# EAGLE design Comm_board_2024_M8N (EAGLE 9.6.2)
CHECKED: 02/25/2025; COMPANY: CDOSR; DATE: 02/25/2024; DESIGNER: CDOSR; DRAWN: 02/25/2024; DRGNO: 1; REV: 01; VERSION: v10; YEAR: 2024
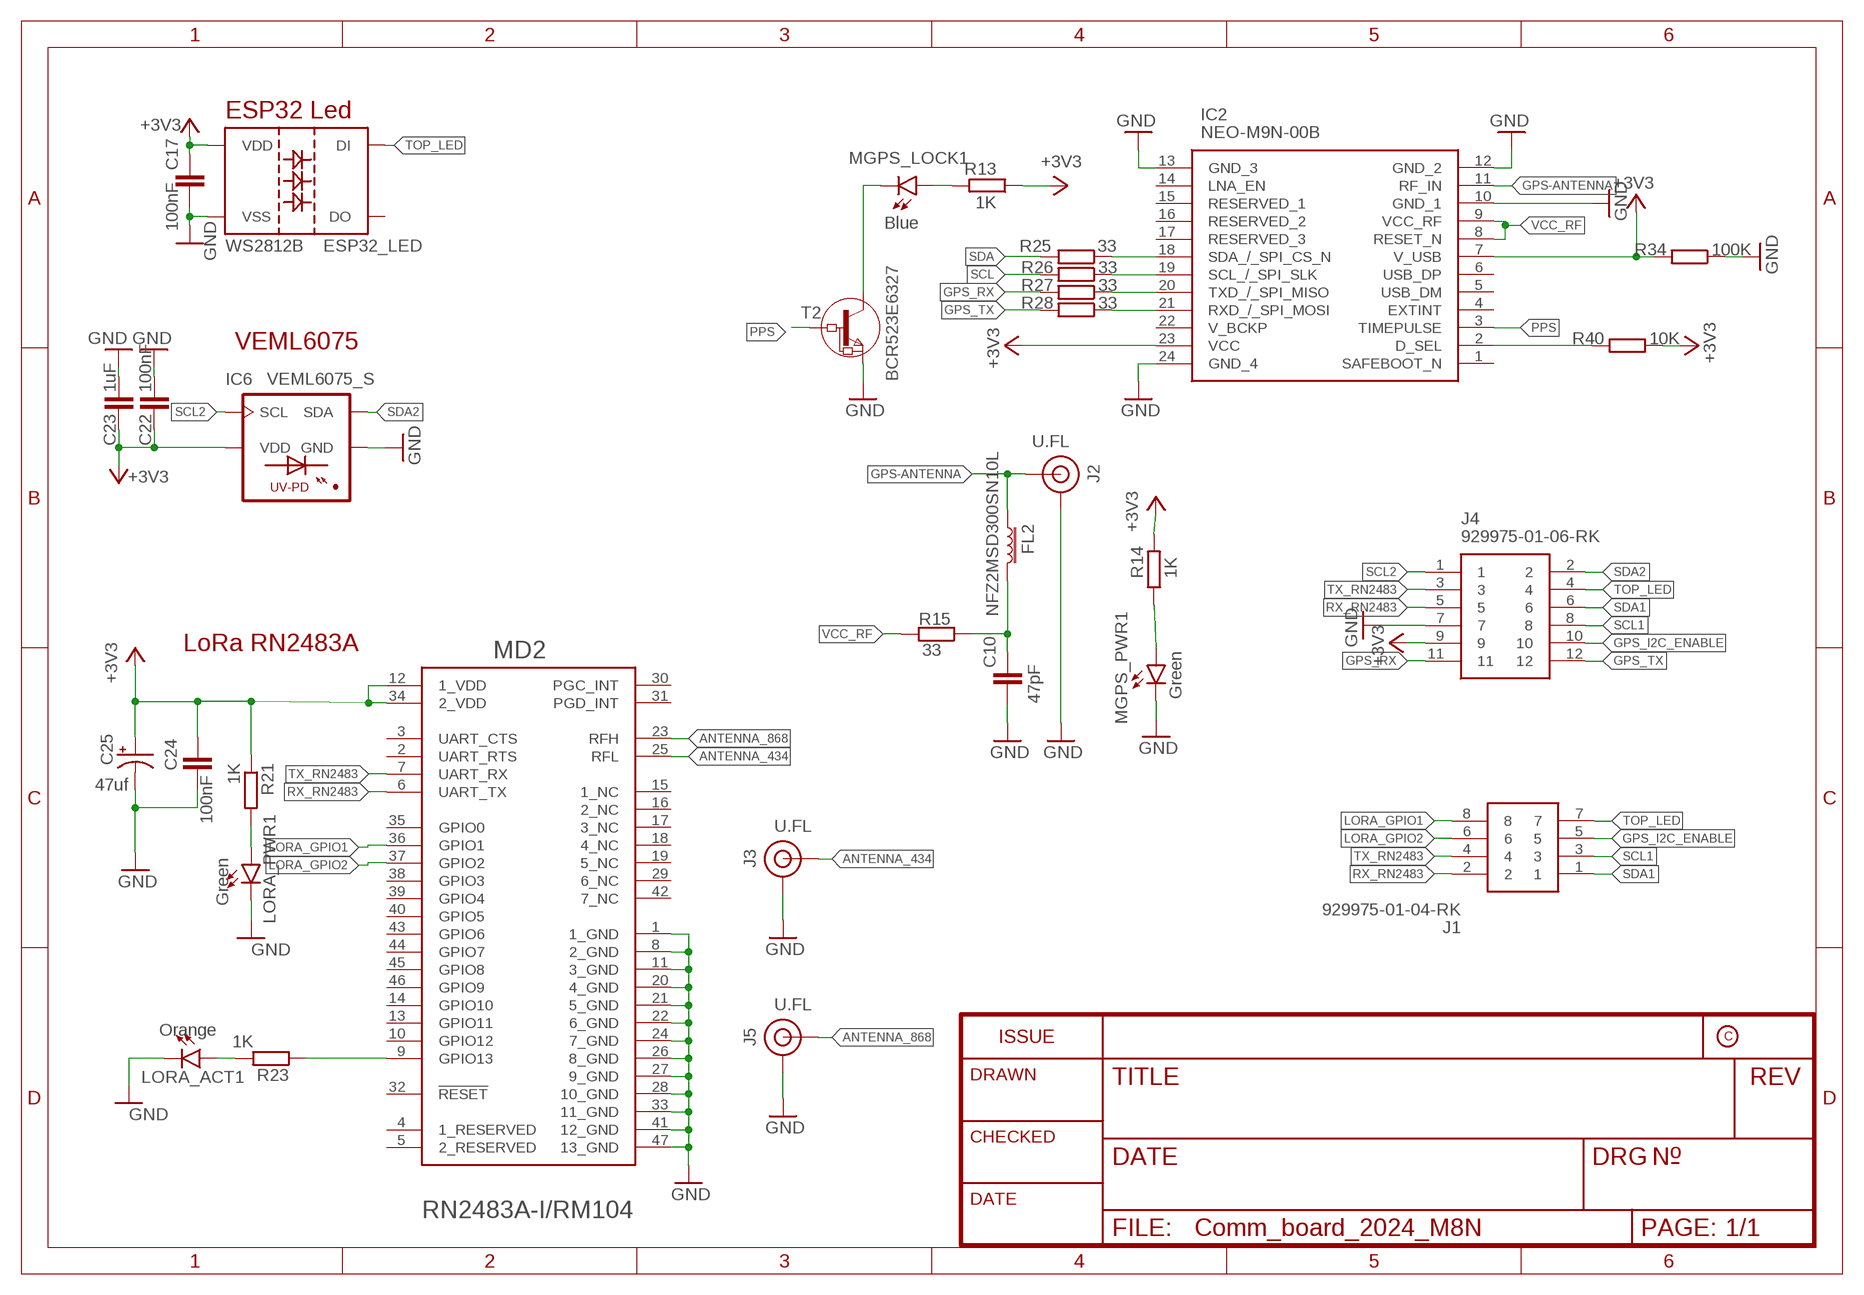
[diagram p0: schematic, sheet 1]

## Parts
C10  47pF  C-EUC0603  [C0603]
C17  100nF  C-EUC0603  [C0603]
C22  100nF  C-EUC0603  [C0603]
C23  1uF  C-EUC0603  [C0603]
C24  100nF  C-EUC0603  [C0603]
C25  47uf  293D226X9025C2TE3  [CAPMP6032X250N]
ESP32_LED  WS2812B  [WS2812B]
FL2  NFZ2MSD300SN10L  [BEADC2016X120N]
IC2  NEO-M9N-00B  [NEOM9N00B]
IC6  VEML6075_S  [VISHAY_VEML6075_1.25X2X1]
J1  929975-01-04-RK  [RHDR8W76P254_2X4_1016X508X839P]
J2  U.FL  SPARKFUN-CONNECTORS_SPARKFUN-CONNECTORS_U.FL2PIN  [SPARKFUN-CONNECTORS_SPARKFUN-CONNECTORS_U.FL]
J3  U.FL  SPARKFUN-CONNECTORS_SPARKFUN-CONNECTORS_U.FL2PIN  [SPARKFUN-CONNECTORS_SPARKFUN-CONNECTORS_U.FL]
J4  929975-01-06-RK  [RHDR12W76P254_2X6_1524X508X839]
J5  U.FL  SPARKFUN-CONNECTORS_SPARKFUN-CONNECTORS_U.FL2PIN  [SPARKFUN-CONNECTORS_SPARKFUN-CONNECTORS_U.FL]
LORA_ACT1  Orange  LEDCHIP-LED0603  [CHIP-LED0603]
LORA_PWR1  Green  LEDCHIP-LED0603  [CHIP-LED0603]
MD2  RM104_MICROCHIP_RN2483A-I-RM104MICROCHIP_RN2483A-I-RM104_0_0  [RM104_MICROCHIP_RN2483A-I-RM104_0]
MGPS_LOCK1  Blue  LEDCHIP-LED0603  [CHIP-LED0603]
MGPS_PWR1  Green  LEDCHIP-LED0603  [CHIP-LED0603]
R13  1K  R-EU_R0603  [R0603]
R14  1K  R-EU_R0603  [R0603]
R15  33  R-EU_R0603  [R0603]
R21  1K  R-EU_R0603  [R0603]
R23  1K  R-EU_R0603  [R0603]
R25  33  R-EU_R0603  [R0603]
R26  33  R-EU_R0603  [R0603]
R27  33  R-EU_R0603  [R0603]
R28  33  R-EU_R0603  [R0603]
R34  100K  R-EU_R0603  [R0603]
R40  10K  R-EU_R0603  [R0603]
T2  BCR523E6327  NPNSOT23  [SOT-23]

## Nets
+3V3: C17.1 C22.2 C23.1 C24.1 C25.1(+) ESP32_LED.1(VDD) IC2.7(V_USB) IC2.23(VCC) IC6.4(VDD) J4.9 MD2.12(1_VDD) MD2.34(2_VDD) R13.1 R14.2 R21.1 R34.2 R40.1
ANTENNA_434: J3.FEED(SIGNAL) MD2.25(RFL)
ANTENNA_868: J5.FEED(SIGNAL) MD2.23(RFH)
GND: C10.2 C17.2 C22.1 C23.2 C24.2 C25.2(-) ESP32_LED.3(VSS) IC2.10(GND_1) IC2.12(GND_2) IC2.13(GND_3) IC2.24(GND_4) IC6.1(GND) J2.1(GND) J2.2(GND) J2.3(GND) J3.1(GND) J3.2(GND) J3.3(GND) J4.7 J5.1(GND) J5.2(GND) J5.3(GND) LORA_ACT1.C LORA_PWR1.C MD2.1(1_GND) MD2.8(2_GND) MD2.11(3_GND) MD2.20(4_GND) MD2.21(5_GND) MD2.22(6_GND) MD2.24(7_GND) MD2.26(8_GND) MD2.27(9_GND) MD2.28(10_GND) MD2.33(11_GND) MD2.41(12_GND) MD2.47(13_GND) MGPS_PWR1.C R34.1 T2.2(E)
GPS-ANTENNA: FL2.1 IC2.11(RF_IN) J2.FEED(SIGNAL)
GPS_I2C_ENABLE: J1.5 J4.10
GPS_RX: J4.11 R27.2
GPS_TX: J4.12 R28.2
LORA_GPIO1: J1.8 MD2.36(GPIO1)
LORA_GPIO2: J1.6 MD2.37(GPIO2)
N$5: MGPS_LOCK1.A R13.2
N$7: MGPS_PWR1.A R14.1
N$13: IC2.20(TXD_/_SPI_MISO) R27.1
N$14: IC2.19(SCL_/_SPI_SLK) R26.1
N$17: IC2.18(SDA_/_SPI_CS_N) R25.1
N$18: IC2.21(RXD_/_SPI_MOSI) R28.1
N$20: IC2.2(D_SEL) R40.2
N$29: MGPS_LOCK1.C T2.1(C)
N$32: C10.1 FL2.2 R15.1
N$41: MD2.9(GPIO13) R23.1
N$42: LORA_ACT1.A R23.2
N$43: LORA_PWR1.A R21.2
PPS: IC2.3(TIMEPULSE) T2.3(B)
RX_RN2483: J1.2 J4.5 MD2.6(UART_TX)
SCL: R26.2
SCL1: J1.3 J4.8
SCL2: IC6.3(SCL) J4.1
SDA: R25.2
SDA1: J1.1 J4.6
SDA2: IC6.2(SDA) J4.2
TOP_LED: ESP32_LED.4(DI) J1.7 J4.4
TX_RN2483: J1.4 J4.3 MD2.7(UART_RX)
VCC_RF: IC2.8(RESET_N) IC2.9(VCC_RF) R15.2
Unconnected: ESP32_LED.2(DO) IC2.1(SAFEBOOT_N) IC2.4(EXTINT) IC2.5(USB_DM) IC2.6(USB_DP) IC2.14(LNA_EN) IC2.15(RESERVED_1) IC2.16(RESERVED_2) IC2.17(RESERVED_3) IC2.22(V_BCKP) MD2.2(UART_RTS) MD2.3(UART_CTS) MD2.4(1_RESERVED) MD2.5(2_RESERVED) MD2.10(GPIO12) MD2.13(GPIO11) MD2.14(GPIO10) MD2.15(1_NC) MD2.16(2_NC) MD2.17(3_NC) MD2.18(4_NC) MD2.19(5_NC) MD2.29(6_NC) MD2.30(PGC_INT) MD2.31(PGD_INT) MD2.32(!RESET!) MD2.35(GPIO0) MD2.38(GPIO3) MD2.39(GPIO4) MD2.40(GPIO5) MD2.42(7_NC) MD2.43(GPIO6) MD2.44(GPIO7) MD2.45(GPIO8) MD2.46(GPIO9)

## Notes on the sheet
- ESP32 Led
- VEML6075
- LoRa RN2483A

## Library data of the parts
C10 C17 C22-C24 = rcl:C-EU: CAPACITOR, European symbol; SPICEPREFIX: C
C25 = 293D226X9025C2TE3:293D226X9025C2TE3: Surface Mount Tantalum Capacitor, TANTAMOUNTr, 293D Series, 22 F, 10%, 25 V, 2412 Check prices <https://pricing.snapeda.com/parts/293D226X9025C2TE3/Vishay/view-part?ref=eda>; AVAILABILITY: Warning; DESCRIPTION: Surface Mount Tantalum Capacitor, TANTAMOUNTr, 293D Series, 22 F, 10%, 25 V, 2412 [6032 Metric]; MF: Vishay; MP: 293D226X9025C2TE3; PACKAGE: None; PRICE: None; PURCHASE-URL: https://pricing.snapeda.com/search/part/293D226X9025C2TE3/?ref=eda
ESP32_LED = WS2812:WS2812B
FL2 = NFZ2MSD300SN10L:NFZ2MSD300SN10L: EMI FILTER SMD 100OHM INFOTMT, A Check availability <https://pricing.snapeda.com/parts/NFZ2MSD300SN10L/Murata/view-part?ref=eda>; AVAILABILITY: In Stock; DESCRIPTION: 30 Ohms @ 10 MHz 1 - Ferrite Bead 0806 (2016 Metric) 3.7A 33mOhm; MF: Murata; MP: NFZ2MSD300SN10L; PACKAGE: 0806 Murata; PRICE: None; PURCHASE-URL: https://pricing.snapeda.com/search/part/NFZ2MSD300SN10L/?ref=eda
IC2 = NEO-M9N-00B:NEO-M9N-00B: M9 standard precision module Source: Datasheet <https://www.u-blox.com/sites/default/files/NEO-M9N_DataSheet_(UBX-19014285).pdf>; DESCRIPTION: M9 standard precision module; HEIGHT: 2.6mm; MANUFACTURER_NAME: U-Blox; MANUFACTURER_PART_NUMBER: NEO-M9N-00B; MOUSER_PART_NUMBER: 377-NEO-M9N-00B; MOUSER_PRICE-STOCK: https://www.mouser.co.uk/ProductDetail/u-blox/NEO-M9N-00B?qs=DPoM0jnrROVeJ6BHpcwcjw%3D%3D
IC6 = VEML6075:VEML6075_S: VEML6075 UVA and UVB Light Sensor with I2C Interface: The VEML6075 senses UVA and UVB light and incorporates photodiode, amplifiers, and analog / digital circuits into a single chip using a CMOS process. When the UV sensor is applied, it is able to detect UVA and UVB intensity to provide a measure of the signal strength as well as allowing for UVI measurement. Device Model created 15.06.2016 by Johannes Kolb - Vishay Semiconductor GmbH; DESCRIPTION: Optical Sensor Ultraviolet _UV_ 330nm, 365nm I²C 4-TFLGA; DIGI-KEY_PART_NUMBER: VEML6075CT-ND; DIGI-KEY_PURCHASE_URL: https://www.digikey.com/product-detail/en/vishay-semiconductor-opto-division/VEML6075/VEML6075CT-ND/5878946?utm_source=snapeda&utm_medium=aggregator&utm_campaign=symbol; MF: Vishay Semiconductor; MP: VEML6075; PACKAGE: TFLGA-4 Vishay
J1 = 929975-01-04-RK:929975-01-04-RK: 8 Position Receptacle Connector 0.100" (2.54mm) Through Hole Tin Source: Datasheet <https://componentsearchengine.com/Datasheets/1/929975-01-04-RK.pdf>; DESCRIPTION: 8 Position Receptacle Connector 0.100" (2.54mm) Through Hole Tin; HEIGHT: 8.387mm; MANUFACTURER_NAME: 3M; MANUFACTURER_PART_NUMBER: 929975-01-04-RK; MOUSER_PART_NUMBER: 517-929975-01-04-RK; MOUSER_PRICE-STOCK: https://www.mouser.com/Search/Refine.aspx?Keyword=517-929975-01-04-RK
J2 J3 J5 = U-FL_Connector:SPARKFUN-CONNECTORS_SPARKFUN-CONNECTORS_U.FL2PIN: SMD Antenna Connector - U.FL 2mm height, 3.0mm x 3.0mm receptacle size. SparkFun Products: SparkFun WiFi Shield - ESP8266 <https://www.sparkfun.com/products/13287> SparkFun ESP8266 Thing <https://www.sparkfun.com/products/13231> SparkFun MiniGen - Pro Mini Signal Generator Shield <https://www.sparkfun.com/products/11420>; PROD_ID: CONN-09193; SF_ID: WRL-09144
J4 = 929975-01-06-RK:929975-01-06-RK: Headers & Wire Housings 2ROW BDMNT SCKT SN STRT SLDR TAIL Source: Datasheet <https://multimedia.3m.com/mws/media/22500O/3mtm-boardmount-skt-100-100x-100strt-sldr-tails-ts0815.pdf>; DESCRIPTION: Headers & Wire Housings 2ROW BDMNT SCKT SN STRT SLDR TAIL; HEIGHT: 8.387mm; MANUFACTURER_NAME: 3M; MANUFACTURER_PART_NUMBER: 929975-01-06-RK; MOUSER_PART_NUMBER: 517-929975-01-06-RK; MOUSER_PRICE-STOCK: https://www.mouser.co.uk/ProductDetail/3M-Electronic-Solutions-Division/929975-01-06-RK?qs=4V84emjyG36joYvi6g1rwA%3D%3D
LORA_ACT1 LORA_PWR1 MGPS_LOCK1 MGPS_PWR1 = led:LED: LED OSRAM: - CHIPLED LG R971, LG N971, LY N971, LG Q971, LY Q971, LO R971, LY R971 LH N974, LH R974 LS Q976, LO Q976, LY Q976 LO Q996 - Hyper CHIPLED LW Q18S LB Q993, LB Q99A, LB R99A - SideLED LS A670, LO A670, LY A670, LG A670, LP A670 LB A673, LV A673, LT A673, LW A673 LH A674 LY A675 LS A676, LA A676, LO A676, LY A676, LW A676 LS A679, LY A679, LG A679 - Hyper Micro SIDELED® LS Y876, LA Y876, LO Y876, LY Y876 LT Y87S - SmartLED LW L88C, LW L88S LB L89C, LB L89S, LG L890 LS L89K, LO L89K, LY L89K LS L896, LA L896, LO L896, LY L896 - TOPLED LS T670, LO T670, LY T670, LG T670, LP T670 LSG T670, LSP T670, LSY T670, LOP T670, LYG T670 LG T671, LOG T671, LSG T671 LB T673, LV T673, LT T673, LW T673 LH T674 LS T676, LA T676, LO T676, LY T676, LB T676, LH T676, LSB T676, LW T676 LB T67C, LV T67C, LT T67C, LS T67K, LO T67K, LY T67K, LW E67C LS E67B, LA E67B, LO E67B, LY E67B, LB E67C, LV E67C, LT E67C LW T67C LS T679, LY T679, LG T679 LS T770, LO T770, LY T770, LG T770, LP T770 LB T773, LV T773, LT T773, LW T773 LH T774 LS E675, LA E675, LY E675, LS T675 LS T776, LA T776, LO T776, LY T776, LB T776 LHGB T686 LT T68C, LB T68C - Hyper Mini TOPLED® LB M676 - Mini TOPLED Santana® LG M470 LS M47K, LO M47K, LY M47K Source: http://www.osram.convergy.de LUXEON: - LUMILED® LXK2-PW12-R00, LXK2-PW12-S00, LXK2-PW14-U00, LXK2-PW14-V00 LXK2-PM12-R00, LXK2-PM12-S00, LXK2-PM14-U00 LXK2-PE12-Q00, LXK2-PE12-R00, LXK2-PE12-S00, LXK2-PE14-T00, LXK2-PE14-U00 LXK2-PB12-K00, LXK2-PB12-L00, LXK2-PB12-M00, LXK2-PB14-N00, LXK2-PB14-P00, LXK2-PB14-Q00 LXK2-PR12-L00, LXK2-PR12-M00, LXK2-PR14-Q00, LXK2-PR14-R00 LXK2-PD12-Q00, LXK2-PD12-R00, LXK2-PD12-S00 LXK2-PH12-R00, LXK2-PH12-S00 LXK2-PL12-P00, LXK2-PL12-Q00, LXK2-PL12-R00 Source: www.luxeon.com KINGBRIGHT: KA-3528ASYC Source: www.kingbright.com
MD2 = main pcb:RM104_MICROCHIP_RN2483A-I-RM104: RN2483A-I/RM104; AUTOMOTIVE: No; BANDWIDTH: 1.74MHz; CENTROID_NOT_SPECIFIED: No; DATASHEET: http://ww1.microchip.com/downloads/en/DeviceDoc/RN2483-Low-Power-Long-Range-LoRa-Technology-Transceiver-Module-Data-Sheet-DS50002346D.pdf; DATA_RATE: 300kbits/s; DEVICE_CLASS_L1: Integrated Circuits (ICs); DEVICE_CLASS_L2: RF Semiconductors and Devices; DEVICE_CLASS_L3: Transceivers; DIGIKEY_DESCRIPTION: UNK RN2483A-I/RM104; DIGIKEY_PART_NUMBER: RN2483A-I/RM104-ND; FOOTPRINT_VARIANT_NAME_0: Recommended_Land_Pattern; HEIGHT: 3.467mm; INTERFACE: I2C,SPI,UART; LEAD_FREE: Yes; MAX_FREQUENCY: 870MHz; MAX_SUPPLY_VOLTAGE: 3.6V; MF: Microchip; MFG_PACKAGE_IDENT: RN2483A-I/RM104; MFG_PACKAGE_IDENT_DATE: 0; MFG_PACKAGE_IDENT_REV: 0; MIN_SUPPLY_VOLTAGE: 2.1V; MOUSER_DESCRIPTION: RF Transceiver Module FSK/GFSK/LoRa 434.79MHz/870MHz 3.3V SMD Tray; MOUSER_PART_NUMBER: 579-RN2483A-I/RM104; MPN: RN2483A-I/RM104; NUMBER_OF_ADC_CHANNELS: 13; NUMBER_OF_GPIO: 14; PACKAGE: TRX_MD_26MM67_17MM78; PREFIX: MD; ROHS: Yes; SENSITIVITY: -146dBm; TEMPERATURE_RANGE_HIGH: +85°C; TEMPERATURE_RANGE_LOW: -40°C; TRANSMITTING_CURRENT: 44.5mA; VERIFICATION_VERSION: 0.0.0.3
R13-R15 R21 R23 R25-R28 R34 R40 = rcl:R-EU_: RESISTOR, European symbol; SPICEPREFIX: R
T2 = zetex:NPNSOT23: NPN TRANSISTOR; MPN: DSS20201L-7; OC_FARNELL: 1710688; OC_NEWARK: 25R4555

## Net classes
0 Default: width 0.203 mm
1 highpower: width 0.305 mm, drill 0.483 mm
2 lowpower: width 0.254 mm, drill 0.483 mm

## Board
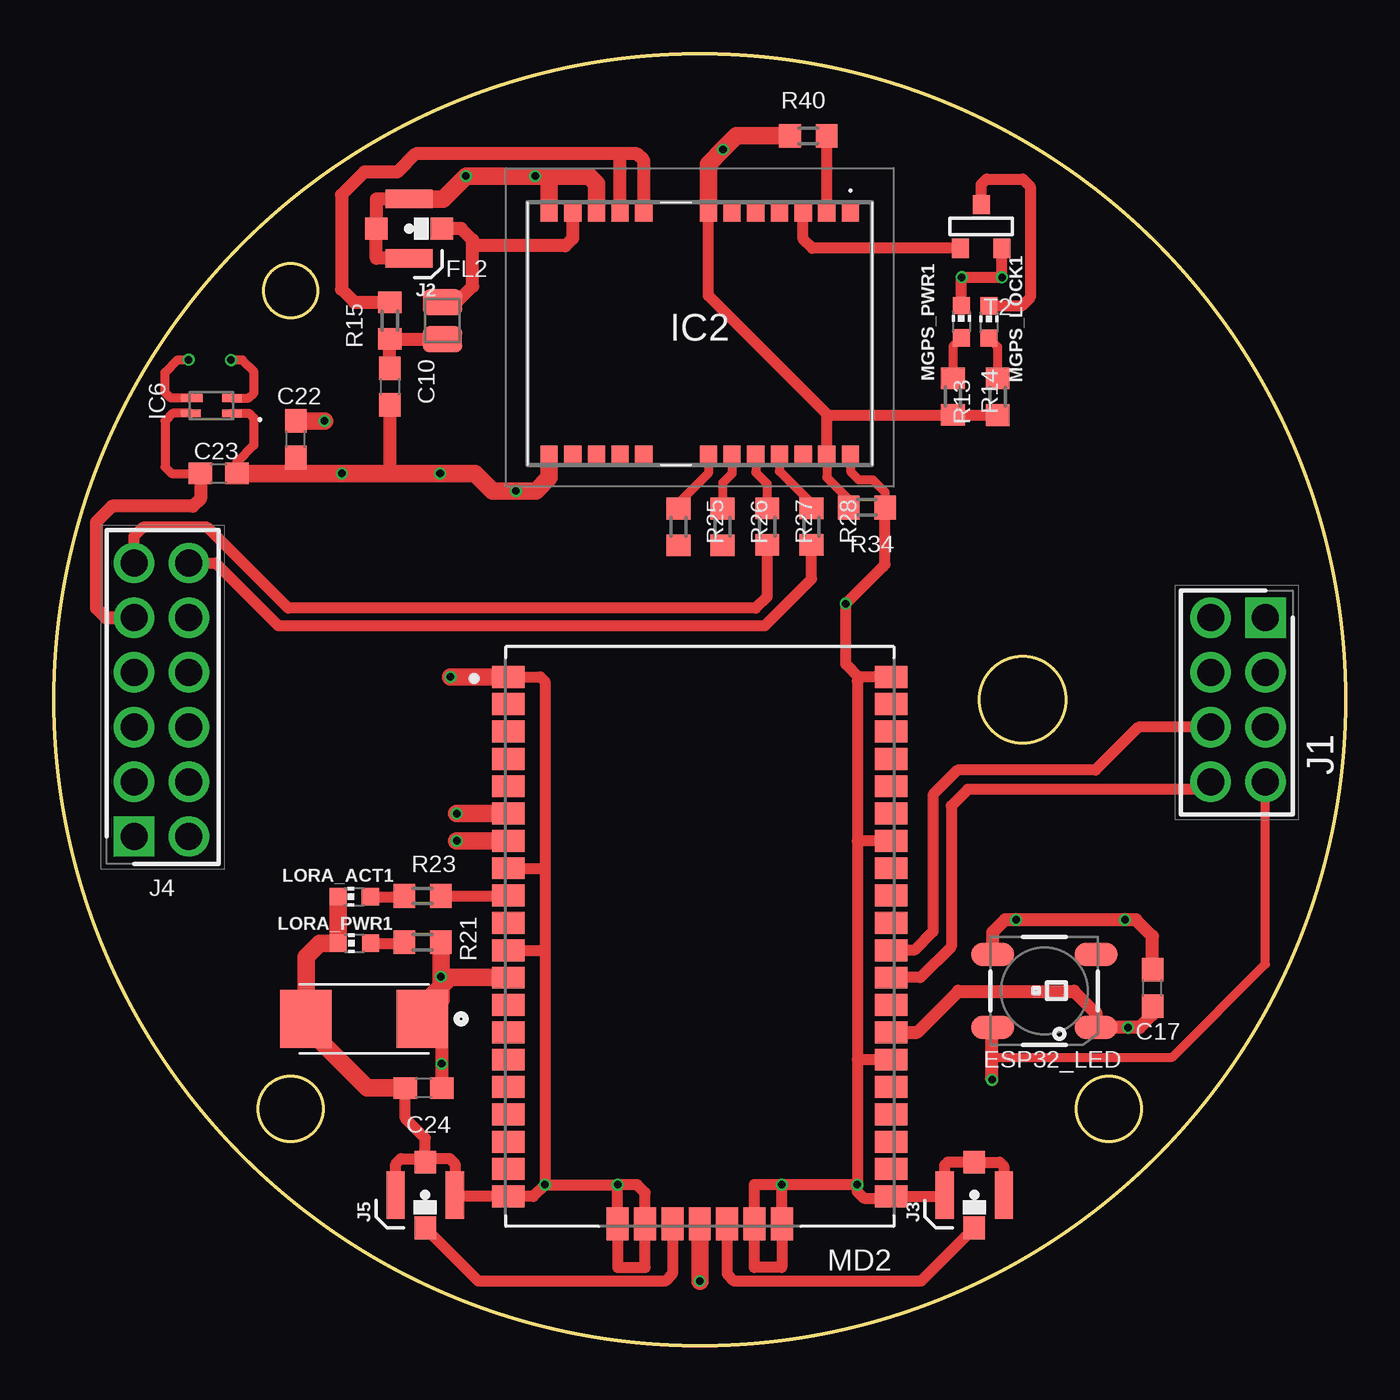
[diagram p1: board, top side]
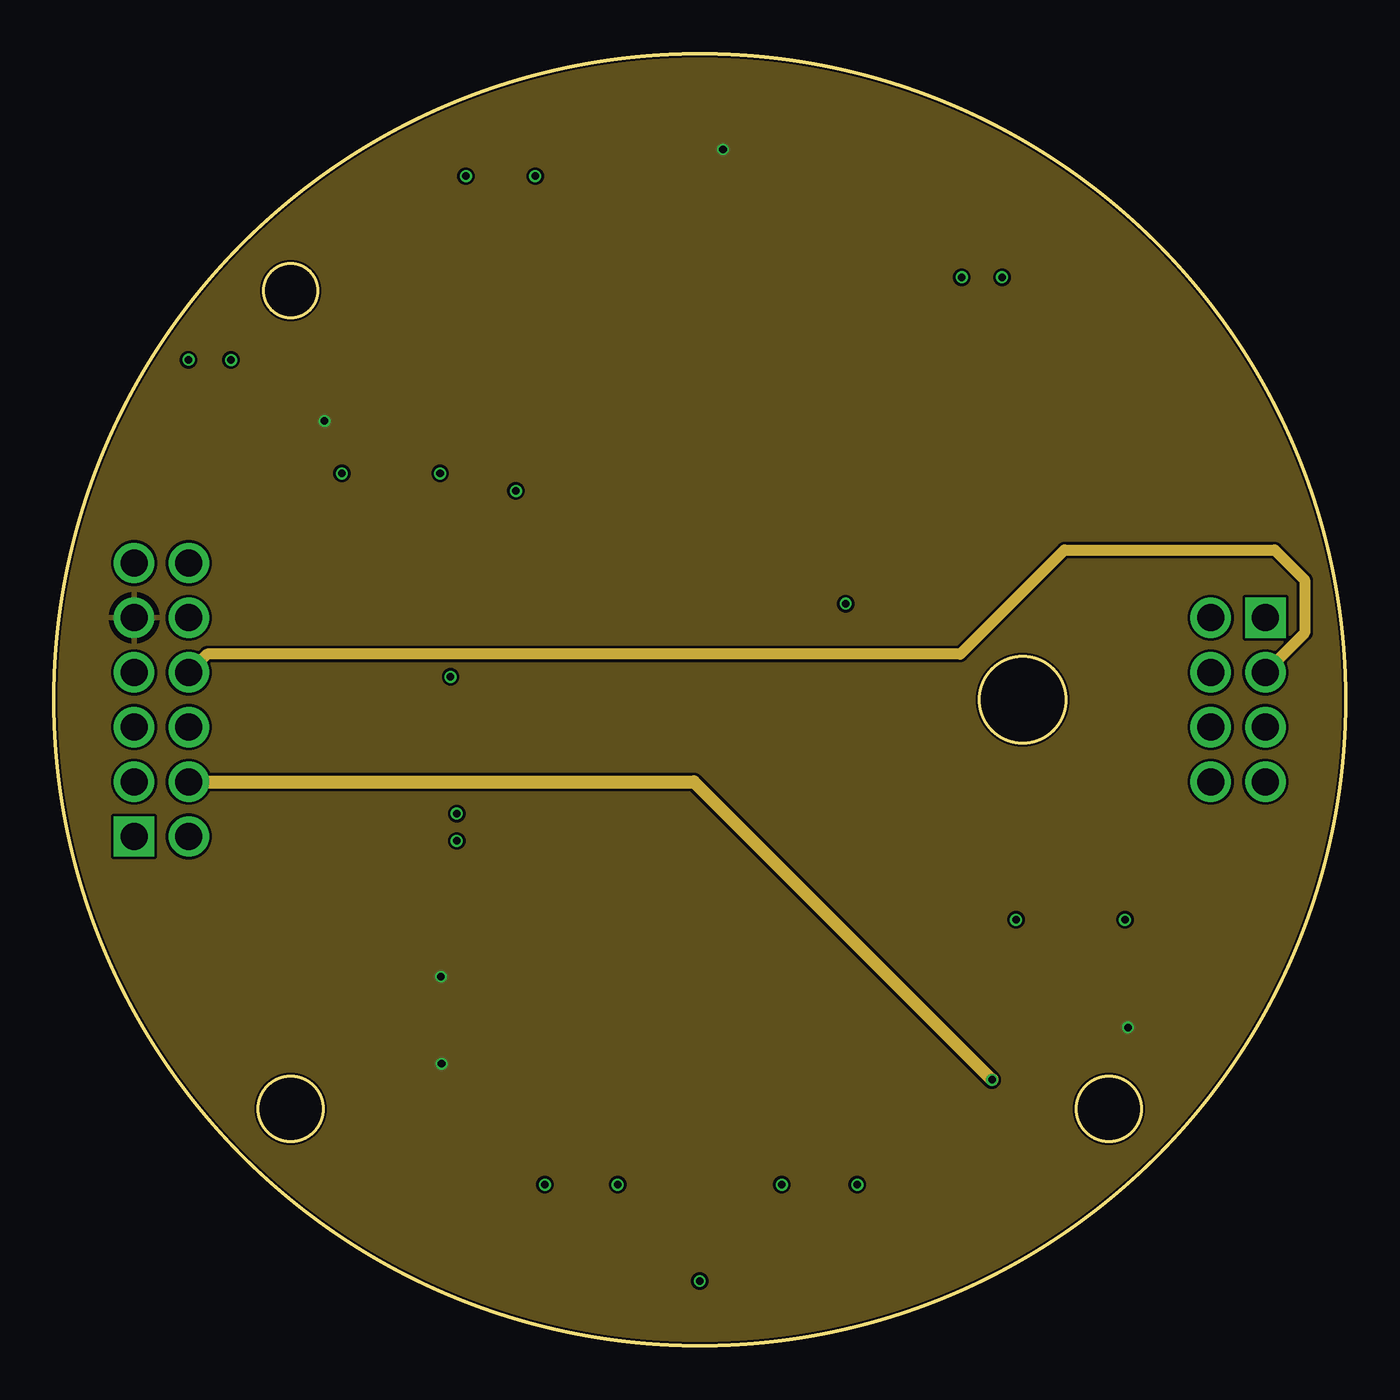
[diagram p2: board, inner layer Route2]
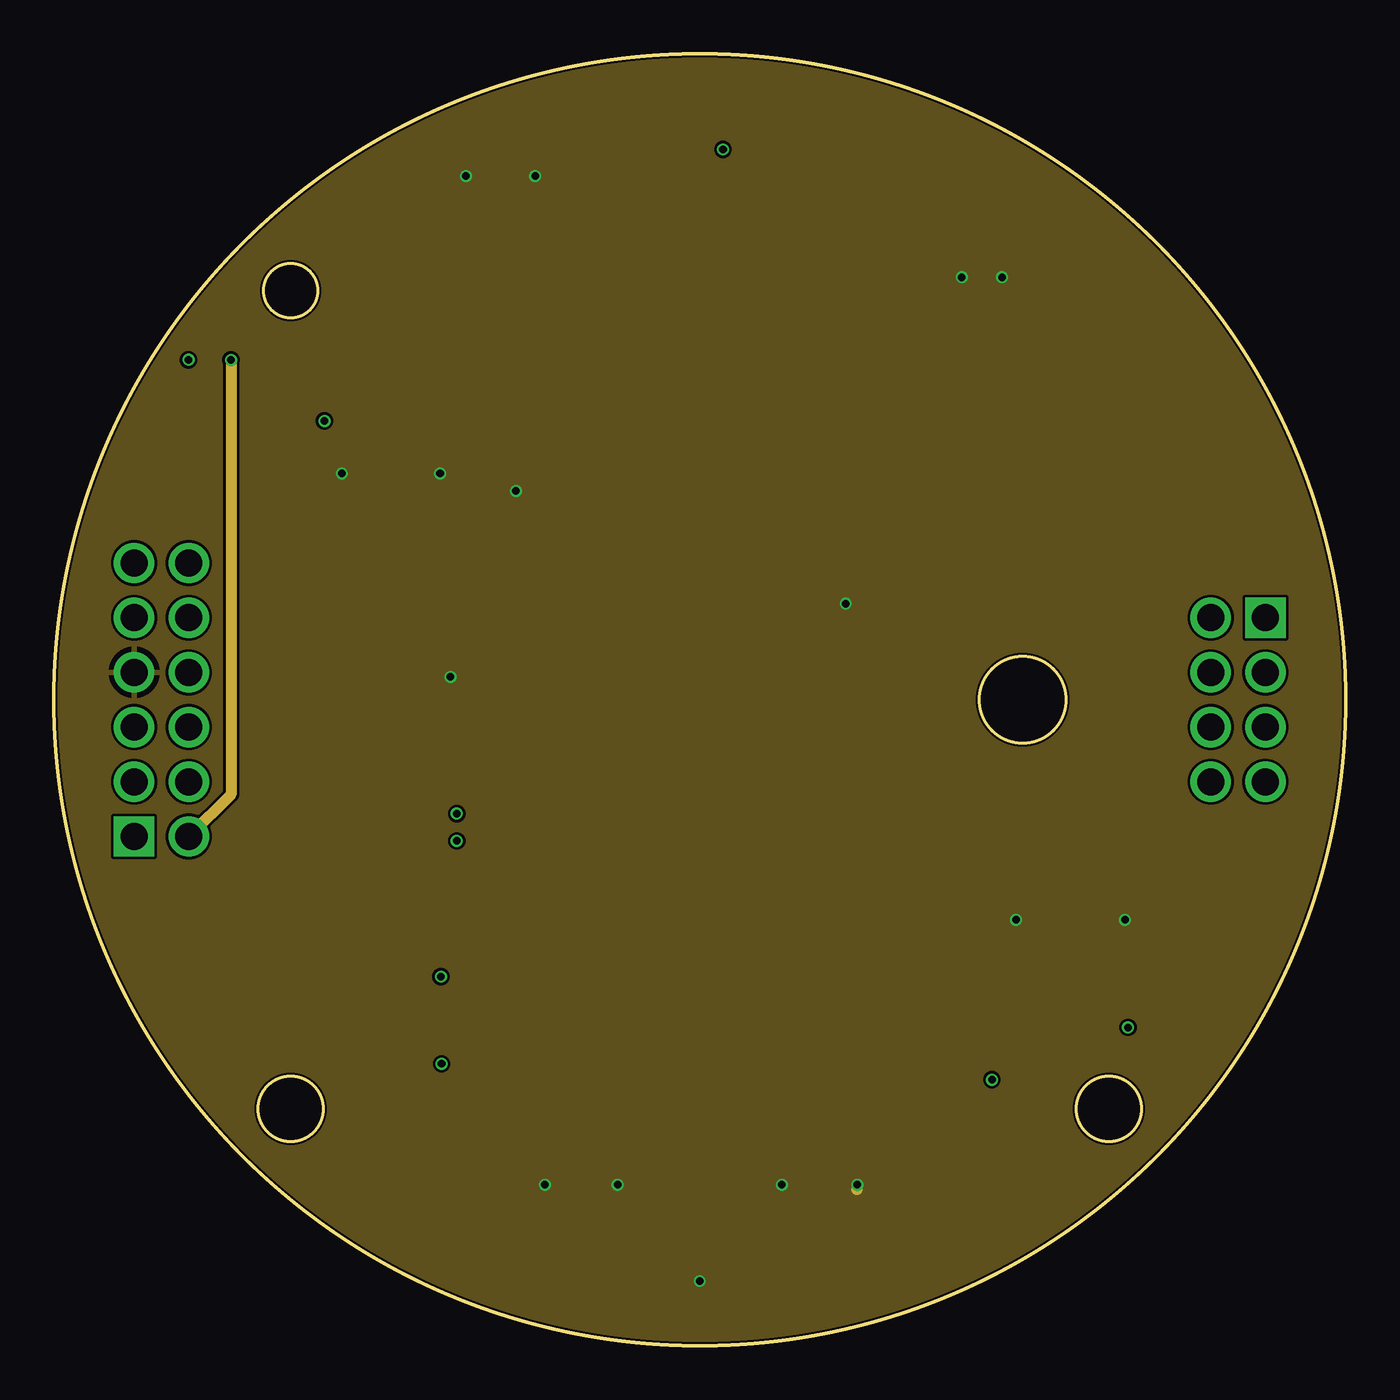
[diagram p3: board, inner layer Route15]
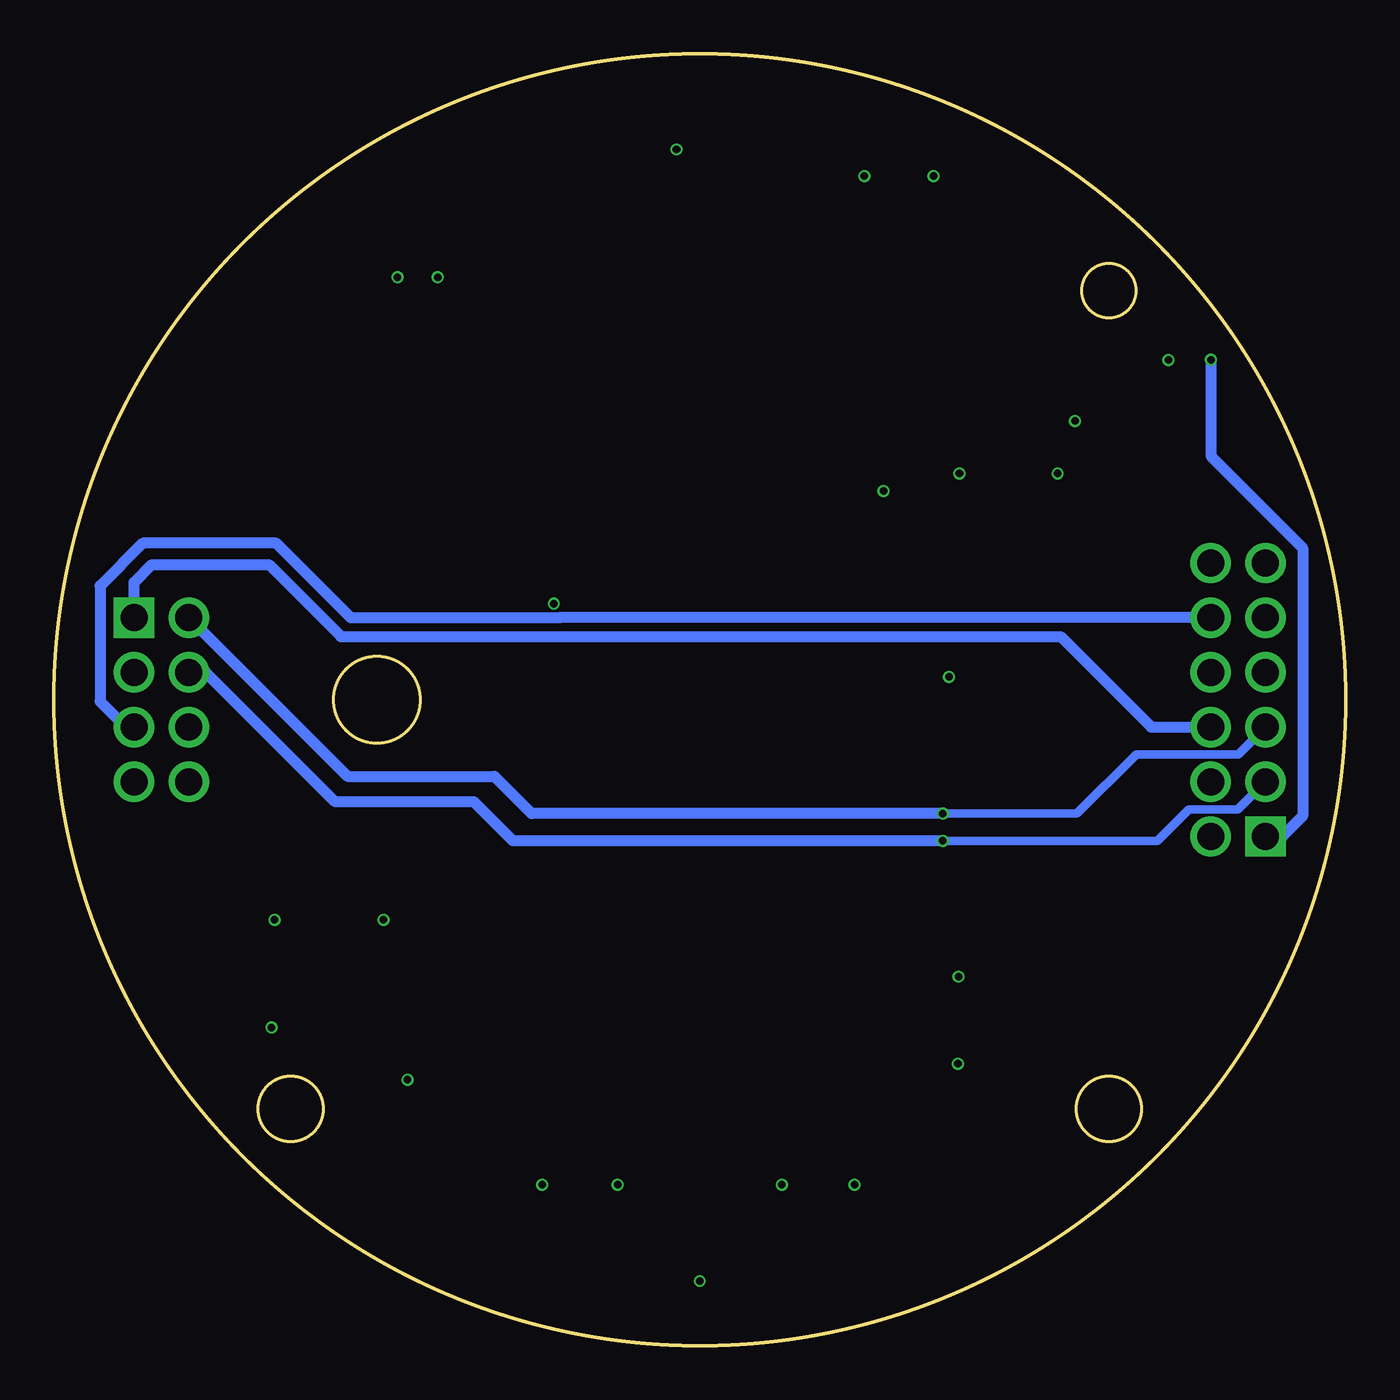
[diagram p4: board, bottom side, seen from below]

Size 60 x 60 mm. Coordinates in mm from the lower left corner, seen from the top.
Outline: circle at 30,30 radius 30
Outline: circle at 11,49 radius 1.25
Outline: circle at 11,11 radius 1.5
Outline: circle at 49,11 radius 1.5
Outline: circle at 45,30 radius 2
Copper layers (1*2*15*16): Top 0.035559375mm / dielectric 0.17018125mm / Route2 0.01778125mm / dielectric 47mil / Route15 0.01778125mm / dielectric 0.17018125mm / Bottom 0.035559375mm
Design rules "jlcpcb-4-layer": minimum track width 5mil, minimum drill 0.2mm, track to track 0.126490625mm, track to pad 0.126490625mm, pad to pad 0.126490625mm, via to via 0.126490625mm, smd to smd 0mil, copper to edge 0.1mm, drill to drill 5mil, minimum pad ring 4mil, minimum via ring 4mil, stop-mask expansion 3mil, vias tented up to drill 100mil, thermal gap 10mil

### Footprints (pad centres in the part's own frame; a part is rotated, then mirrored left to right if it is on the bottom)
C0603 = smd 1.1 x 1: 1 -0.85,0; 2 0.85,0
CAPMP6032X250N = smd 2.4 x 2.7: 1 -2.7,0; 2 2.7,0
WS2812B = smd 2 x 1.1: 1 -2.4,1.7; 2 -2.4,-1.7; 3 2.4,-1.7; 4 2.4,1.7
BEADC2016X120N = smd 1.2 x 1.82: 1 -0.86,0; 2 0.86,0
NEOM9N00B = smd 0.8 x 0.9: 1 7,5.65; 2 5.9,5.65; 3 4.8,5.65; 4 3.7,5.65; 5 2.6,5.65; 6 1.5,5.65; 7 0.4,5.65; 8 -2.6,5.65; 9 -3.7,5.65; 10 -4.8,5.65; 11 -5.9,5.65; 12 -7,5.65; 13 -7,-5.65; 14 -5.9,-5.65; 15 -4.8,-5.65; 16 -3.7,-5.65; 17 -2.6,-5.65; 18 0.4,-5.65; 19 1.5,-5.65; 20 2.6,-5.65; 21 3.7,-5.65; 22 4.8,-5.65; 23 5.9,-5.65; 24 7,-5.65
VISHAY_VEML6075_1.25X2X1 = smd 0.9 x 0.35: 1 -0.95,0.35; 2 -0.95,-0.35; 4 0.95,0.35 | smd 1 x 0.35: 3 0.9,-0.35
RHDR8W76P254_2X4_1016X508X839P = drill 1.25 pad 1.875 square: 1 3.81,-1.27 | drill 1.25 pad 1.875: 2 3.81,1.27; 3 1.27,-1.27; 4 1.27,1.27; 5 -1.27,-1.27; 6 -1.27,1.27; 7 -3.81,-1.27; 8 -3.81,1.27
SPARKFUN-CONNECTORS_SPARKFUN-CONNECTORS_U.FL = smd 2.2 x 0.85: 1 0,1.375; 2 0,-1.375 | smd 1.05 x 1: 3 1.525,0; FEED -1.525,0
RHDR12W76P254_2X6_1524X508X839 = drill 1.25 pad 1.875 square: 1 6.35,-1.27 | drill 1.25 pad 1.875: 2 6.35,1.27; 3 3.81,-1.27; 4 3.81,1.27; 5 1.27,-1.27; 6 1.27,1.27; 7 -1.27,-1.27; 8 -1.27,1.27; 9 -3.81,-1.27; 10 -3.81,1.27; 11 -6.35,-1.27; 12 -6.35,1.27
CHIP-LED0603 = smd 0.8 x 0.8: A 0,-0.75; C 0,0.75
RM104_MICROCHIP_RN2483A-I-RM104_0 = smd 1.524 x 1.016: 1 8.89,-12.065; 2 8.89,-10.795; 3 8.89,-9.525; 4 8.89,-8.255; 5 8.89,-6.985; 6 8.89,-5.715; 7 8.89,-4.445; 8 8.89,-3.175; 9 8.89,-1.905; 10 8.89,-0.635; 11 8.89,0.635; 12 8.89,1.905; 13 8.89,3.175; 14 8.89,4.445; 15 8.89,5.715; 16 8.89,6.985; 17 8.89,8.255; 18 8.89,9.525; 19 8.89,10.795; 20 8.89,12.065; 28 -8.89,12.065; 29 -8.89,10.795; 30 -8.89,9.525; 31 -8.89,8.255; 32 -8.89,6.985; 33 -8.89,5.715; 34 -8.89,4.445; 35 -8.89,3.175; 36 -8.89,1.905; 37 -8.89,0.635; 38 -8.89,-0.635; 39 -8.89,-1.905; 40 -8.89,-3.175; 41 -8.89,-4.445; 42 -8.89,-5.715; 43 -8.89,-6.985; 44 -8.89,-8.255; 45 -8.89,-9.525; 46 -8.89,-10.795; 47 -8.89,-12.065 | smd 1.016 x 1.524: 21 3.81,13.335; 22 2.54,13.335; 23 1.27,13.335; 24 0,13.335; 25 -1.27,13.335; 26 -2.54,13.335; 27 -3.81,13.335
R0603 = smd 1 x 1.1: 1 -0.85,0; 2 0.85,0
SOT-23 = smd 0.787 x 0.889: 1 0.025,-1.016; 2 -0.94,1.016; 3 0.991,1.016

### Placement (x,y rotation side)
C10  15.6,44.54 270 top
C17  51.03,16.62 90 top
C22  11.24,42.1 90 top
C23  7.66,40.51 0 top
C24  17.17,11.97 180 top
C25  14.41,15.18 180 top
ESP32_LED  46,16.48 180 top
FL2  18.05,47.6 270 top
IC2  30,47 0 top
IC6  7.32,43.66 180 top
J1  55,30 90 top
J2  16.5,51.88 180 top
J3  42.75,7 90 top
J4  5,30 270 top
J5  17.25,7 90 top
LORA_ACT1  13.95,20.85 90 top
LORA_PWR1  13.96,18.69 90 top
MD2  30,19 180 top
MGPS_LOCK1  43.43,47.54 0 top
MGPS_PWR1  42.15,47.56 0 top
R13  43.83,44.07 90 top
R14  41.76,44.08 270 top
R15  15.61,47.61 90 top
R21  17.13,18.74 180 top
R23  17.13,20.89 180 top
R25  29.01,38.03 270 top
R26  31.06,38.03 270 top
R27  33.13,38.04 270 top
R28  35.19,38.04 270 top
R34  37.76,38.93 180 top
R40  35.04,56.19 0 top
T2  43.1,51.98 180 top

### Tracks (layer width: path | path; a pad name or v marks a point on that pad's centre or on a via)
+3V3  (via drill 0.35)
  Top 0.406: IC6.4 5.53,43.31 5.17,42.95 5.17,40.81 5.47,40.51 C23.1 | IC2.23 35.9,40.32 36.91,39.31 R34.2
  Top 0.508: 18.39,17.09 18.02,17.09 v17.98,17.14 | R13.1 R14.2 35.9,43.23 | IC2.23 35.9,43.23 | 35.9,43.23 35.9,43.26 30.4,48.76 30.4,52.95
  Top 0.61: C17.1 51.03,15.38 50.43,14.78 v49.89,14.78 ESP32_LED.1 48.4,15.44 47.38,16.46 42.01,16.46 40.11,14.55 MD2.34 | C24.1 v18.01,13.09 18.01,15.12 17.53,15.6 | C23.1 6.81,39.34 6.46,38.99 2.71,38.99 1.97,38.25 1.97,34.25 2.41,33.81 J4.9
  Top 0.813: R21.1 v17.98,17.14 17.98,16.05 17.53,15.6 C25.1 17.11,15.81 18.39,17.09 MD2.12 | C22.2 v12.57,42.95 | R40.1 31.71,56.19 v31.08,55.56 30.4,54.88 30.4,52.95 IC2.7
  pour Route2: -5,65 65,65 65,-5 -5,-5
ANTENNA_434
  Top 0.508: MD2.25 31.27,3.33 31.6,3 40.27,3 J3.FEED
ANTENNA_868
  Top 0.508: MD2.23 28.73,3.33 28.4,3 19.73,3 J5.FEED
GND  (via drill 0.35)
  Top 0.406: IC6.1 9.07,43.31 9.29,43.09 9.29,41.82 8.51,41.04 C23.2 | IC2.24 37,40.6 37.38,40.22 38.03,40.22 38.61,39.64 R34.1
  Top 0.508: 38.53,36.17 38.49,36.17 | 38.49,36.17 v36.78,34.46 36.78,31.65 37.44,30.99 | MD2.47 37.52,31.07 37.44,30.99 | 37.44,30.99 37.32,30.87 37.32,23.44 | 37.32,23.44 37.32,13.29 | 37.32,13.29 v37.32,7.48 | v37.32,7.48 37.32,7.15 37.62,6.85 38.8,6.85 MD2.28 41.31,6.93 J3.1 41.38,8.39 41.52,8.52 J3.3 43.94,8.52 44.12,8.34 J3.2 | MD2.33 37.33,13.29 37.32,13.29 | MD2.41 37.33,23.45 37.32,23.44 | v37.32,7.48 v33.81,7.48 | v33.81,7.48 32.54,7.48 MD2.26 32.54,3.64 33.81,3.64 MD2.27 v33.81,7.48 | MD2.1 22.59,31.07 22.81,30.85 22.81,22.16 | 22.81,22.16 22.81,18.35 | 22.81,18.35 v22.81,7.48 | v22.81,7.48 22.27,6.93 MD2.20 18.69,6.93 J5.2 18.62,8.45 18.4,8.68 17.41,8.68 J5.3 | J5.1 15.88,8.45 16.11,8.68 17.09,8.68 J5.3 | J5.3 17.25,9.63 16.32,10.56 C24.2 | v26.19,7.48 27.09,7.48 27.46,7.11 MD2.22 27.46,3.63 26.19,3.63 MD2.21 v26.19,7.48 | v22.81,7.48 v26.19,7.48 | MD2.11 22.8,18.37 22.81,18.35 | MD2.8 22.8,22.18 22.81,22.16 | 38.49,36.17 38.61,36.29 R34.1 | MGPS_PWR1.C 42.15,49.6 v42.17,49.62 v44.04,49.62 T2.2
  Top 0.61: C17.2 51.03,19.01 50.26,19.78 v49.75,19.78 v44.69,19.78 44.18,19.78 43.6,19.2 ESP32_LED.3 | C10.2 15.6,40.52 15.61,40.51 | J2.1 14.97,50.5 J2.3 14.97,53.25 J2.2
  Top 0.813: C24.2 14.55,11.97 11.71,14.81 C25.2 11.71,18.06 12.34,18.69 LORA_PWR1.C LORA_ACT1.C | C23.2 11.23,40.51 11.24,40.52 C22.1 11.24,40.57 11.3,40.51 v13.38,40.51 15.61,40.51 v17.94,40.51 19.57,40.51 20.38,39.7 v21.46,39.7 22.39,39.7 23,40.31 IC2.13 | MD2.24 v30,3 30.01,2.98 | MD2.1 v18.43,31.07 | IC2.12 23,54.15 22.83,54.32 v22.36,54.32 | J2.2 18.07,53.25 v19.14,54.32 v22.36,54.32 | IC2.10 25.2,53.97 24.85,54.32 v22.36,54.32
  Route15 0.508: v37.32,7.48 37.31,7.26 37.3,7.26
  pour Route15: -3,63 63,63 63,-3 -3,-3
GPS-ANTENNA
  Top 0.61: FL2.1 18.71,48.46 19.45,49.2 19.45,51.08 | 19.45,51.08 19.45,51.35 18.92,51.88 J2.FEED | IC2.11 24.1,51.42 23.76,51.08 19.45,51.08
GPS_I2C_ENABLE
  Top 0.508: J1.5 56.3,28.76
  Bottom 0.508: J4.10 36.5,33.81 36.51,33.8 46.2,33.8 49.67,37.27 55.86,37.27 57.85,35.29 57.85,29.92 56.65,28.73 J1.5
GPS_RX
  Top 0.508: R27.2 33.13,34.78 32.6,34.25 10.88,34.25 7.12,38.02 4.15,38.02 3.73,37.6 J4.11
GPS_TX
  Top 0.508: J4.12 7.52,36.35 10.44,33.43 33.01,33.43 35.19,35.61 R28.2
LORA_GPIO1
  Top 0.508: J1.8 53.38,25.84 42.45,25.84 41.68,25.07 41.68,18.53 40.24,17.09 MD2.36
LORA_GPIO2
  Top 0.508: J1.6 50.38,28.73 48.38,26.73 41.97,26.73 40.83,25.59 40.83,19.23 39.97,18.37 MD2.37
N$5
  Top 0.406: MGPS_LOCK1.A 43.83,46.39 R13.2
N$7
  Top 0.406: MGPS_PWR1.A 41.76,46.42 R14.1
N$13
  Top 0.406: IC2.20 32.6,40.56 33.13,40.03 R27.1
N$14
  Top 0.406: IC2.19 31.5,40.51 31.06,40.07 R26.1
N$17
  Top 0.406: IC2.18 30.4,40.52 29.01,39.13 R25.1
N$18
  Top 0.406: IC2.21 33.7,40.62 35.19,39.13 R28.1
N$20
  Top 0.508: IC2.2 R40.2
N$29
  Top 0.508: T2.1 43.08,53.94 43.32,54.18 45,54.18 45.35,53.83 45.35,48.68 44.96,48.29 MGPS_LOCK1.C
N$32
  Top 0.61: C10.1 R15.1 18.03,46.76 FL2.2
N$41
  Top 0.508: R23.1 21.09,20.89 MD2.9
N$42
  Top 0.508: LORA_ACT1.A 16.24,20.85 R23.2
N$43
  Top 0.508: LORA_PWR1.A 16.23,18.69 R21.2
PPS
  Top 0.508: T2.3 35.23,50.96 34.8,51.39 IC2.3
RX_RN2483  (via drill 0.35)
  Top 0.813: MD2.6 v18.71,24.71
  Bottom 0.4: v18.71,24.71 12.48,24.71 9.72,27.47 4.99,27.47 J4.5
  Bottom 0.508: v18.71,24.71 37.8,24.71 39.53,26.44 46.36,26.44 J1.2
SCL1
  Route2 0.508: J4.8 7.12,32.12 42.1,32.12 46.94,36.96 56.7,36.96 58.1,35.56 58.1,33.1 J1.3
SCL2  (via drill 0.35)
  Top 0.406: IC6.3 5.43,44.01 5.17,44.27 5.17,45.2 5.76,45.79 v6.26,45.79
  Bottom 0.508: v6.26,45.79 6.26,41.32 1.99,37.06 1.99,24.59 2.94,23.65 J4.1
SDA1
  Bottom 0.508: J1.1 56.27,35.45 55.45,36.27 50,36.27 46.66,32.93 13.23,32.93 9.03,28.73 J4.6
SDA2  (via drill 0.35)
  Top 0.406: IC6.2 9.06,44.01 9.3,44.25 9.3,45.23 8.75,45.78 v8.23,45.78
  Route15 0.508: v8.23,45.78 8.23,25.61 J4.2
TOP_LED  (via drill 0.35)
  Top 0.406: ESP32_LED.4 43.6,13.42 43.62,13.4 51.94,13.4 56.27,17.73 J1.7
  Top 0.61: v43.57,12.35 43.57,14.78 ESP32_LED.4
  Route2 0.61: J4.4 29.73,26.19 v43.57,12.35
TX_RN2483  (via drill 0.35)
  Top 0.813: MD2.7 v18.71,23.45
  Bottom 0.4: v18.71,23.45 8.75,23.45 7.28,24.91 5.01,24.91 J4.3
  Bottom 0.508: v18.71,23.45 38.67,23.45 40.49,25.26 46.93,25.26 52.94,31.27 J1.4
VCC_RF
  Top 0.61: IC2.9 26.3,55.24 26.18,55.36 | R15.2 13.97,48.46 13.36,49.07 13.36,53.45 14.42,54.51 15.96,54.51 16.81,55.36 26.18,55.36 | IC2.8 27.4,55.05 27.09,55.36 26.18,55.36